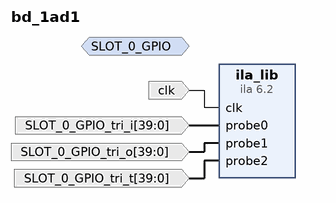
[diagram p0: block diagram of the top level]
# Vivado block design bd_1ad1, xczu28dr-ffvg1517-2-e, Vivado 2020.1
create_bd_design bd_1ad1

create_bd_intf_port -mode Monitor -vlnv xilinx.com:interface:gpio_rtl:1.0 SLOT_0_GPIO
create_bd_port -dir I -type clk clk
create_bd_port -dir I -from 39 -to 0 SLOT_0_GPIO_tri_i
create_bd_port -dir I -from 39 -to 0 SLOT_0_GPIO_tri_o
create_bd_port -dir I -from 39 -to 0 SLOT_0_GPIO_tri_t

create_bd_cell -type ip -vlnv xilinx.com:ip:ila:6.2 ila_lib
set_property -dict [list \
  CONFIG.ALL_PROBE_SAME_MU TRUE \
  CONFIG.ALL_PROBE_SAME_MU_CNT 1 \
  CONFIG.C_ADV_TRIGGER FALSE \
  CONFIG.C_DATA_DEPTH 4096 \
  CONFIG.C_EN_STRG_QUAL 0 \
  CONFIG.C_EN_TIME_TAG 0 \
  CONFIG.C_ILA_CLK_FREQ 99999001 \
  CONFIG.C_INPUT_PIPE_STAGES 0 \
  CONFIG.C_MONITOR_TYPE Native \
  CONFIG.C_NUM_OF_PROBES 3 \
  CONFIG.C_PROBE0_TYPE 0 \
  CONFIG.C_PROBE0_WIDTH 40 \
  CONFIG.C_PROBE1_TYPE 0 \
  CONFIG.C_PROBE1_WIDTH 40 \
  CONFIG.C_PROBE2_TYPE 0 \
  CONFIG.C_PROBE2_WIDTH 40 \
  CONFIG.C_TIME_TAG_WIDTH 32 \
  CONFIG.C_TRIGIN_EN false \
  CONFIG.C_TRIGOUT_EN false \
  CONFIG.C_XLNX_HW_PROBE_INFO DEFAULT \
] [get_bd_cells ila_lib]

# ---- connections ----

connect_bd_net [get_bd_ports clk] [get_bd_pins ila_lib/clk]
connect_bd_net [get_bd_ports SLOT_0_GPIO_tri_i] [get_bd_pins ila_lib/probe0]
connect_bd_net [get_bd_ports SLOT_0_GPIO_tri_o] [get_bd_pins ila_lib/probe1]
connect_bd_net [get_bd_ports SLOT_0_GPIO_tri_t] [get_bd_pins ila_lib/probe2]

validate_bd_design
save_bd_design
